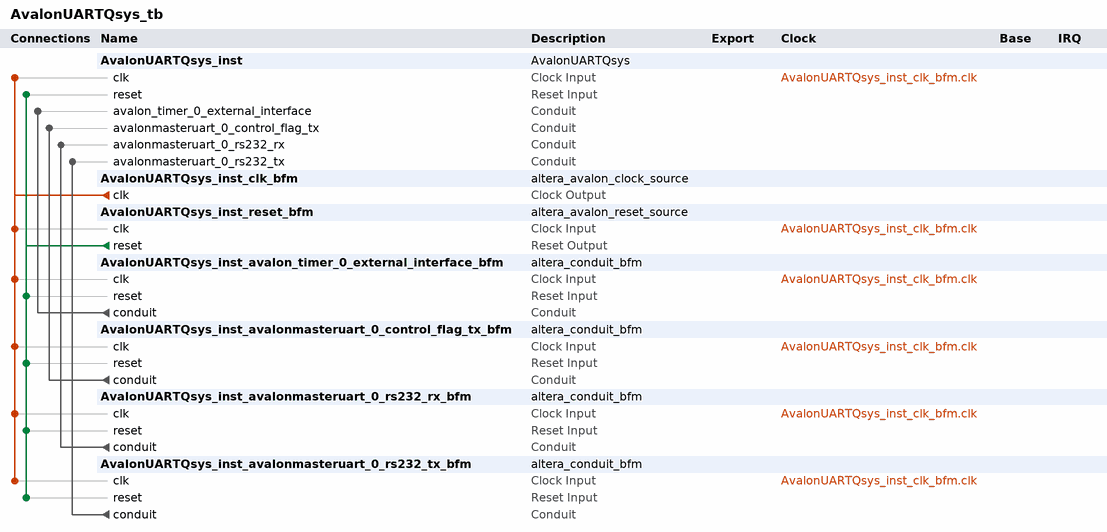
[diagram p0: system contents]
# Platform Designer (Qsys) system AvalonUARTQsys_tb, Cyclone IV E EP4CE115F29C7
# Parameters at their usual value, and those the tool derives, are not listed.
package require -exact qsys 17.1
create_system AvalonUARTQsys_tb
set_project_property DEVICE_FAMILY {Cyclone IV E}
set_project_property DEVICE EP4CE115F29C7

add_instance AvalonUARTQsys_inst AvalonUARTQsys 1.0

add_instance AvalonUARTQsys_inst_clk_bfm altera_avalon_clock_source 17.1

add_instance AvalonUARTQsys_inst_reset_bfm altera_avalon_reset_source 17.1
set_instance_parameter_value AvalonUARTQsys_inst_reset_bfm ASSERT_HIGH_RESET 0
set_instance_parameter_value AvalonUARTQsys_inst_reset_bfm INITIAL_RESET_CYCLES 50

add_instance AvalonUARTQsys_inst_avalon_timer_0_external_interface_bfm altera_conduit_bfm 17.1
set_instance_parameter_value AvalonUARTQsys_inst_avalon_timer_0_external_interface_bfm CLOCKED_SIGNAL true
set_instance_parameter_value AvalonUARTQsys_inst_avalon_timer_0_external_interface_bfm ENABLE_RESET true
set_instance_parameter_value AvalonUARTQsys_inst_avalon_timer_0_external_interface_bfm SIGNAL_DIRECTIONS input
set_instance_parameter_value AvalonUARTQsys_inst_avalon_timer_0_external_interface_bfm SIGNAL_ROLES conduit
set_instance_parameter_value AvalonUARTQsys_inst_avalon_timer_0_external_interface_bfm SIGNAL_WIDTHS 1

add_instance AvalonUARTQsys_inst_avalonmasteruart_0_control_flag_tx_bfm altera_conduit_bfm 17.1
set_instance_parameter_value AvalonUARTQsys_inst_avalonmasteruart_0_control_flag_tx_bfm CLOCKED_SIGNAL true
set_instance_parameter_value AvalonUARTQsys_inst_avalonmasteruart_0_control_flag_tx_bfm ENABLE_RESET true
set_instance_parameter_value AvalonUARTQsys_inst_avalonmasteruart_0_control_flag_tx_bfm SIGNAL_DIRECTIONS output
set_instance_parameter_value AvalonUARTQsys_inst_avalonmasteruart_0_control_flag_tx_bfm SIGNAL_ROLES flag_tx
set_instance_parameter_value AvalonUARTQsys_inst_avalonmasteruart_0_control_flag_tx_bfm SIGNAL_WIDTHS 1

add_instance AvalonUARTQsys_inst_avalonmasteruart_0_rs232_rx_bfm altera_conduit_bfm 17.1
set_instance_parameter_value AvalonUARTQsys_inst_avalonmasteruart_0_rs232_rx_bfm CLOCKED_SIGNAL true
set_instance_parameter_value AvalonUARTQsys_inst_avalonmasteruart_0_rs232_rx_bfm ENABLE_RESET true
set_instance_parameter_value AvalonUARTQsys_inst_avalonmasteruart_0_rs232_rx_bfm SIGNAL_DIRECTIONS output
set_instance_parameter_value AvalonUARTQsys_inst_avalonmasteruart_0_rs232_rx_bfm SIGNAL_ROLES rx
set_instance_parameter_value AvalonUARTQsys_inst_avalonmasteruart_0_rs232_rx_bfm SIGNAL_WIDTHS 1

add_instance AvalonUARTQsys_inst_avalonmasteruart_0_rs232_tx_bfm altera_conduit_bfm 17.1
set_instance_parameter_value AvalonUARTQsys_inst_avalonmasteruart_0_rs232_tx_bfm CLOCKED_SIGNAL true
set_instance_parameter_value AvalonUARTQsys_inst_avalonmasteruart_0_rs232_tx_bfm ENABLE_RESET true
set_instance_parameter_value AvalonUARTQsys_inst_avalonmasteruart_0_rs232_tx_bfm SIGNAL_DIRECTIONS input
set_instance_parameter_value AvalonUARTQsys_inst_avalonmasteruart_0_rs232_tx_bfm SIGNAL_ROLES tx
set_instance_parameter_value AvalonUARTQsys_inst_avalonmasteruart_0_rs232_tx_bfm SIGNAL_WIDTHS 1

# connections
add_connection AvalonUARTQsys_inst_clk_bfm.clk AvalonUARTQsys_inst.clk clock
add_connection AvalonUARTQsys_inst_clk_bfm.clk AvalonUARTQsys_inst_avalon_timer_0_external_interface_bfm.clk clock
add_connection AvalonUARTQsys_inst_clk_bfm.clk AvalonUARTQsys_inst_avalonmasteruart_0_control_flag_tx_bfm.clk clock
add_connection AvalonUARTQsys_inst_clk_bfm.clk AvalonUARTQsys_inst_avalonmasteruart_0_rs232_rx_bfm.clk clock
add_connection AvalonUARTQsys_inst_clk_bfm.clk AvalonUARTQsys_inst_avalonmasteruart_0_rs232_tx_bfm.clk clock
add_connection AvalonUARTQsys_inst_clk_bfm.clk AvalonUARTQsys_inst_reset_bfm.clk clock
add_connection AvalonUARTQsys_inst_reset_bfm.reset AvalonUARTQsys_inst.reset reset
add_connection AvalonUARTQsys_inst_reset_bfm.reset AvalonUARTQsys_inst_avalon_timer_0_external_interface_bfm.reset reset
add_connection AvalonUARTQsys_inst_reset_bfm.reset AvalonUARTQsys_inst_avalonmasteruart_0_control_flag_tx_bfm.reset reset
add_connection AvalonUARTQsys_inst_reset_bfm.reset AvalonUARTQsys_inst_avalonmasteruart_0_rs232_rx_bfm.reset reset
add_connection AvalonUARTQsys_inst_reset_bfm.reset AvalonUARTQsys_inst_avalonmasteruart_0_rs232_tx_bfm.reset reset
add_connection AvalonUARTQsys_inst_avalon_timer_0_external_interface_bfm.conduit AvalonUARTQsys_inst.avalon_timer_0_external_interface conduit
add_connection AvalonUARTQsys_inst_avalonmasteruart_0_control_flag_tx_bfm.conduit AvalonUARTQsys_inst.avalonmasteruart_0_control_flag_tx conduit
add_connection AvalonUARTQsys_inst_avalonmasteruart_0_rs232_rx_bfm.conduit AvalonUARTQsys_inst.avalonmasteruart_0_rs232_rx conduit
add_connection AvalonUARTQsys_inst_avalonmasteruart_0_rs232_tx_bfm.conduit AvalonUARTQsys_inst.avalonmasteruart_0_rs232_tx conduit

set_interconnect_requirement {$system} qsys_mm.clockCrossingAdapter HANDSHAKE
set_interconnect_requirement {$system} qsys_mm.enableEccProtection FALSE
set_interconnect_requirement {$system} qsys_mm.insertDefaultSlave FALSE
set_interconnect_requirement {$system} qsys_mm.maxAdditionalLatency 1

save_system AvalonUARTQsys_tb.qsys
